# Altium project 2.2 - AD_EXPANSION_for_28379D_LAUNCHXL.PrjPcb
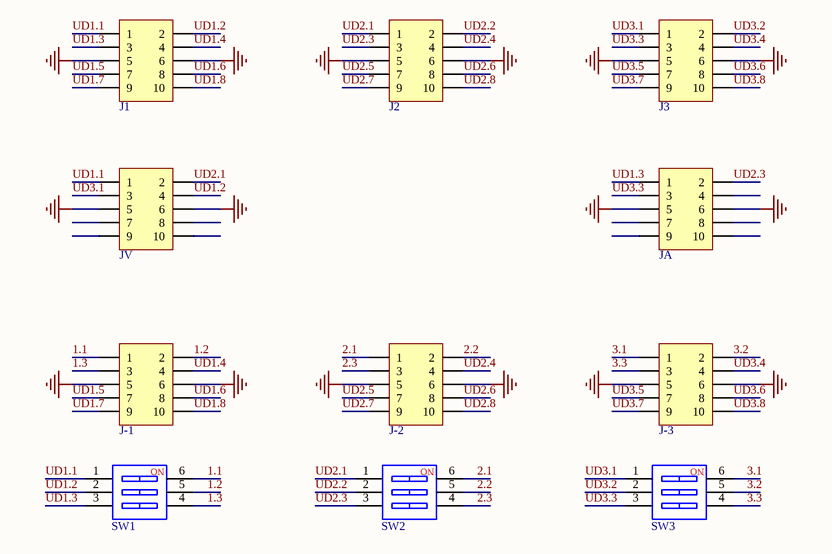
[diagram p0: Sheet1.SchDoc]
1 sheet, 11 parts. Net scope: global (net labels, ports and power ports of the same name join across sheets).
Board file: PCB1.PcbDoc

## Sheet Sheet1.SchDoc
size A4; Organization: Altium Limited; Address1: L3, 12a Rodborough Rd; Address2: Frenchs Forest; Address3: NSW; Address4: Australia 2086

### Parts
J1  Header 5X2  [HDR2.54-LI-2x5P]  (value not drawn)
J2  Header 5X2  [HDR2.54-LI-2x5P]  (value not drawn)
J3  Header 5X2  [HDR2.54-LI-2x5P]  (value not drawn)
J-1  Header 5X2  [IDC2.54-LI-2x5P]  (value not drawn)
J-2  Header 5X2  [IDC2.54-LI-2x5P]  (value not drawn)
J-3  Header 5X2  [IDC2.54-LI-2x5P]  (value not drawn)
JA  Header 5X2  [IDC2.54-LI-2x5P]  (value not drawn)
JV  Header 5X2  [IDC2.54-LI-2x5P]  (value not drawn)
SW1  SW-3P  [CSW DIP-3P]  (value not drawn)
SW2  SW-3P  [CSW DIP-3P]  (value not drawn)
SW3  SW-3P  [CSW DIP-3P]  (value not drawn)

### Nets
GND: J1.5 J1.6 J2.5 J2.6 J3.5 J3.6 J-1.5 J-1.6 J-2.5 J-2.6 J-3.5 J-3.6 JA.5 JA.6 JV.5 JV.6
1.1: J-1.1 SW1.6
1.2: J-1.2 SW1.5
1.3: J-1.3 SW1.4
2.1: J-2.1 SW2.6
2.2: J-2.2 SW2.5
2.3: J-2.3 SW2.4
3.1: J-3.1 SW3.6
3.2: J-3.2 SW3.5
3.3: J-3.3 SW3.4
UD1.1: J1.1 JV.1 SW1.1
UD1.2: J1.2 JV.4 SW1.2
UD1.3: J1.3 JA.1 SW1.3
UD1.4: J1.4 J-1.4
UD1.5: J1.7 J-1.7
UD1.6: J1.8 J-1.8
UD1.7: J1.9 J-1.9
UD1.8: J1.10 J-1.10
UD2.1: J2.1 JV.2 SW2.1
UD2.2: J2.2 SW2.2
UD2.3: J2.3 JA.2 SW2.3
UD2.4: J2.4 J-2.4
UD2.5: J2.7 J-2.7
UD2.6: J2.8 J-2.8
UD2.7: J2.9 J-2.9
UD2.8: J2.10 J-2.10
UD3.1: J3.1 JV.3 SW3.1
UD3.2: J3.2 SW3.2
UD3.3: J3.3 JA.3 SW3.3
UD3.4: J3.4 J-3.4
UD3.5: J3.7 J-3.7
UD3.6: J3.8 J-3.8
UD3.7: J3.9 J-3.9
UD3.8: J3.10 J-3.10

Not connected (* = marked no-connect by the designer): JA 4 7 8 9 10; JV 7 8 9 10

### Notes on the sheet
- Title
- Size:
- Date:
- A4
- Number:
- Time:
- Revision:
- Sheet
- of
- File:
- (in symbol SW-3P) NO

### Library data of the parts
J1-J3 J-1-J-3 JA JV = Header 5X2: 5*2P接插件; 淘宝ID: 小糖豆的小窝窝; BOM名称: 5*2P接插件; 下单链接: https://item.taobao.com/item.htm?ft=t&id=613637044352
SW1-SW3 = SW-3P: 3路编码开关; 淘宝ID: 小糖豆的小窝窝; BOM名称: 3路编码开关; 下单链接: https://item.taobao.com/item.htm?ft=t&id=613637044352